# EAGLE design Spectacle_LED_Control_Board (EAGLE 7.6.0)
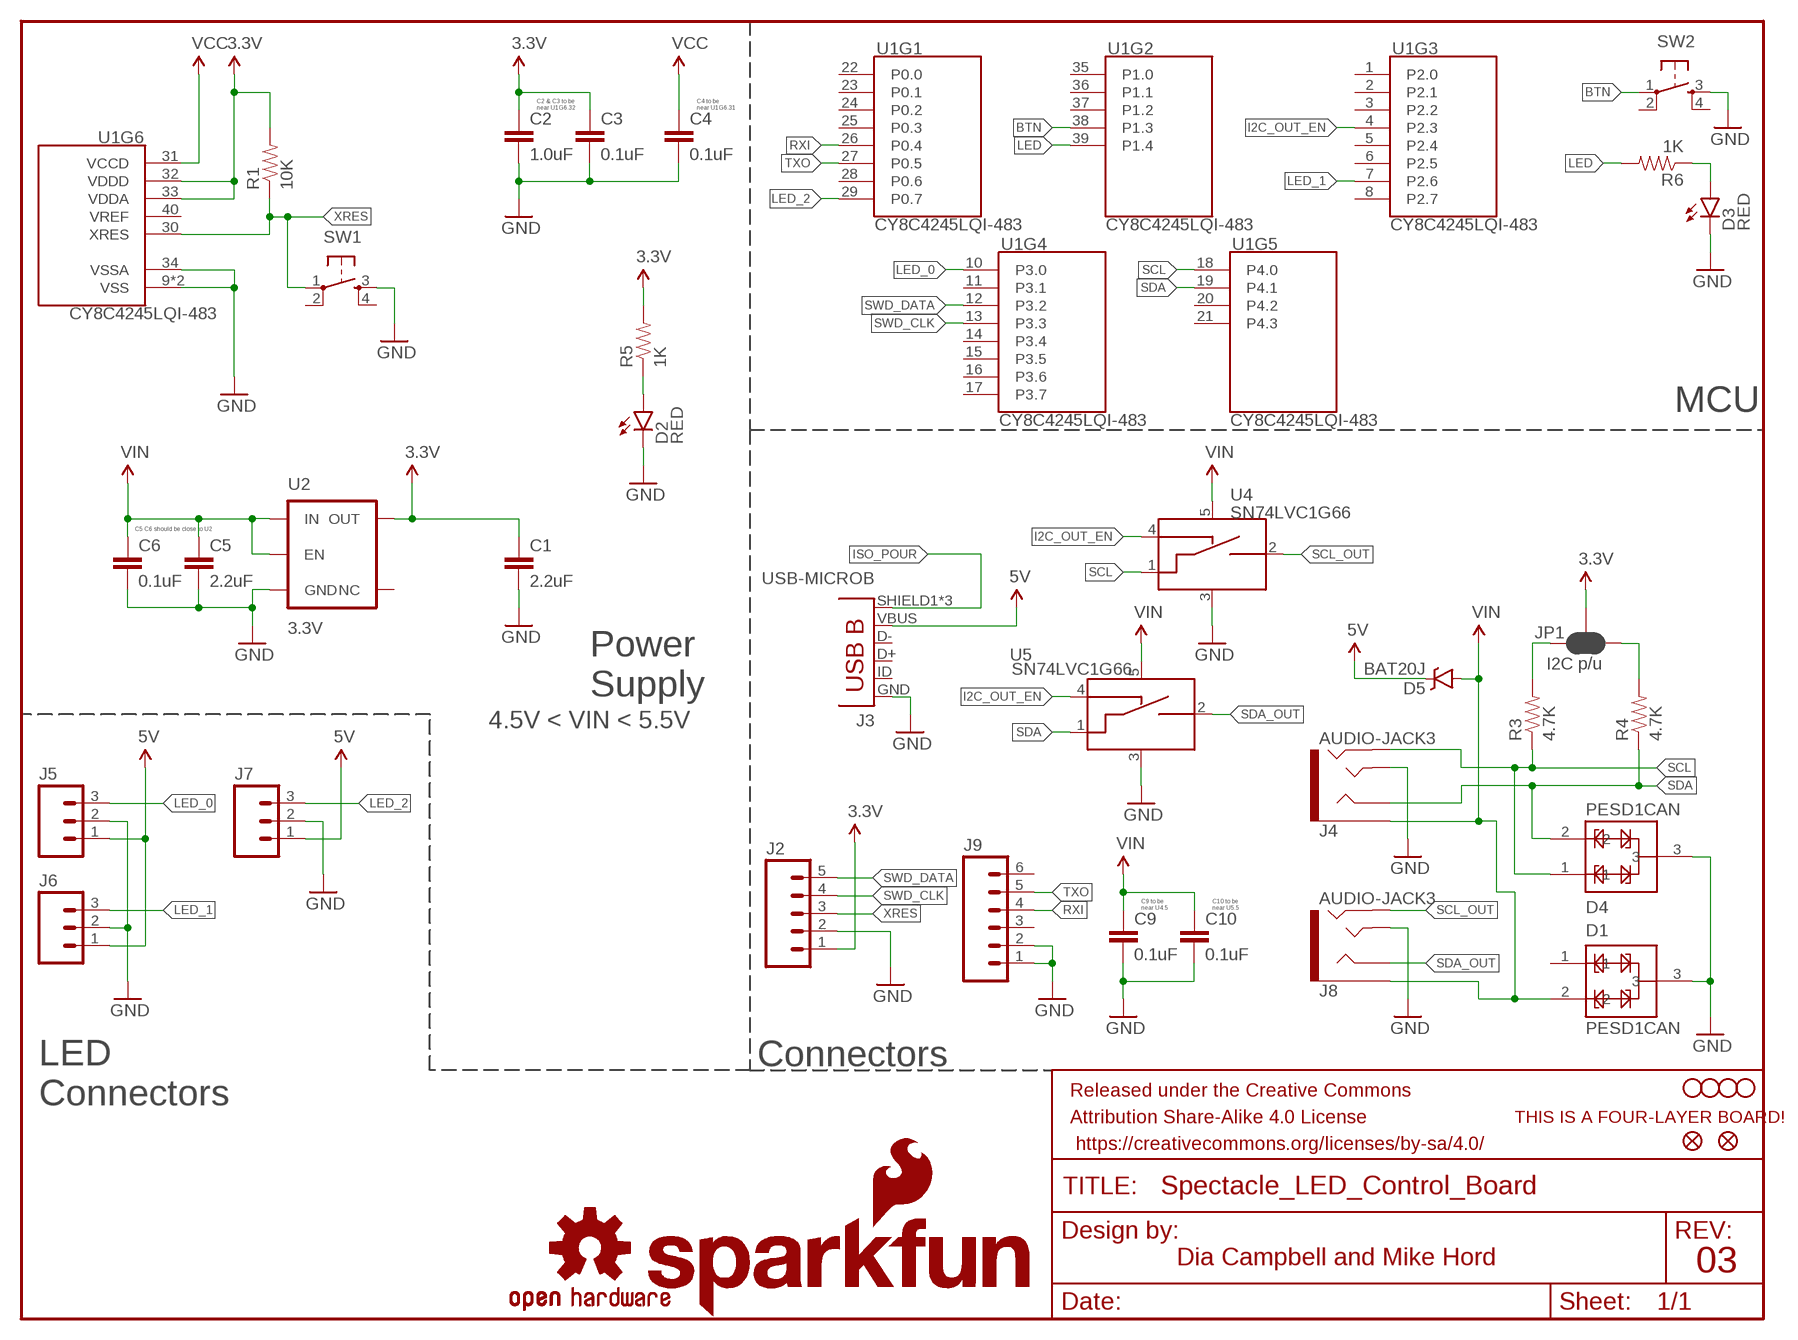
[diagram p0: schematic, sheet 1]

## Parts
C1  2.2uF  2.2UF-10V-20%(0603)  [0603-CAP]
C2  1.0uF  1.0UF-16V-10%(0402)  [0402-CAP]
C3  0.1uF  0.1UF-16V(+-10%)(0402)  [0402-CAP]
C4  0.1uF  0.1UF-16V(+-10%)(0402)  [0402-CAP]
C5  2.2uF  2.2UF-10V-20%(0603)  [0603-CAP]
C6  0.1uF  0.1UF-16V(+-10%)(0402)  [0402-CAP]
C9  0.1uF  0.1UF-16V(+-10%)(0402)  [0402-CAP]
C10  0.1uF  0.1UF-16V(+-10%)(0402)  [0402-CAP]
D1  PESD1CAN  [SOT23-3]
D2  RED  LED-RED0603  [LED-0603]
D3  RED  LED-RED0603  [LED-0603]
D4  PESD1CAN  [SOT23-3]
D5  BAT20J  DIODE-SCHOTTKY-BAT20J  [SOD-323]
FD1  FIDUCIALUFIDUCIAL  [MICRO-FIDUCIAL]
FD2  FIDUCIALUFIDUCIAL  [MICRO-FIDUCIAL]
FRAME1  FRAME-LETTER  [CREATIVE_COMMONS]
H1  STAND-OFF  [STAND-OFF]
H2  STAND-OFF  [STAND-OFF]
H3  STAND-OFF  [STAND-OFF]
H4  STAND-OFF  [STAND-OFF]
J2  M05NO_SILK  [1X05_NO_SILK]
J3  USB-MICROB  USB-MICROB"  [USB-B-MICRO-SMD_V03]
J4  AUDIO-JACK3  [AUDIO-JACK-TRRS-SMD]
J5  M03JST-PTH-VERT  [JST-3-PTH-VERT]
J6  M03JST-PTH-VERT  [JST-3-PTH-VERT]
J7  M03JST-PTH-VERT  [JST-3-PTH-VERT]
J8  AUDIO-JACK3  [AUDIO-JACK-TRRS-SMD]
J9  M06NO_SILK_NO_POP  [1X06_NO_SILK]
JP1  JUMPER-PAD-3-NC_BY_PASTE  [PAD-JUMPER-3-NC_BY_PASTE_YES_SILK_FULL_BOX]
LOGO1  OSHW-LOGOS  [OSHW-LOGO-S]
LOGO2  SFE_LOGO_NAME_FLAME.1_INCH  [SFE_LOGO_NAME_FLAME_.1]
R1  10K  10KOHM-1/10W-1%(0603)0603  [0603-RES]
R3  4.7K  4.7KOHM-1/10W-1%(0603)  [0603-RES]
R4  4.7K  4.7KOHM-1/10W-1%(0603)  [0603-RES]
R5  1K  1KOHM-1/10W-1%(0603)  [0603-RES]
R6  1K  1KOHM-1/10W-1%(0603)  [0603-RES]
SW1  SWITCH_SPST_4_PINRECT  [TACTILE_SWITCH_SMD_4.6X2.8MM]
SW2  SWITCH_SPST_4_PINRECT  [TACTILE_SWITCH_SMD_4.6X2.8MM]
U1  CY8C4245LQI-483  PSOC4_4200_40QFN  [QFN-40]
U2  3.3V  V_REG_AP2112K-3.3V  [SOT23-5]
U4  SN74LVC1G66  SN74LVC1G66_SPST_AMUX  [SOT23-5]
U5  SN74LVC1G66  SN74LVC1G66_SPST_AMUX  [SOT23-5]
U$1  FOUR_LAYER_WARNING  [FOUR_LAYER_WARNING]

## Nets
3.3V: C1.1 C2.1 C3.1 J2.1 JP1.2 R1.2 R5.2 U1.32(VDDD) U1.33(VDDA) U2.5(OUT)
5V: D5.C J3.VBUS J5.1 J6.1 J7.1
BTN: SW2.1 U1.38(P1.3)
GND: C1.2 C2.2 C3.2 C4.2 C5.2 C6.2 C9.2 C10.2 D1.3 D2.C D3.C D4.3 J2.2 J3.GND J4.TIP J5.2 J6.2 J7.2 J8.TIP J9.1 J9.2 SW1.3 SW2.3 U1.9(VSS) U1.34(VSSA) U1.EP(VSS) U2.2(GND) U4.3(VSS) U5.3(VSS)
I2C_OUT_EN: U1.4(P2.3) U4.4(CTRL_IN) U5.4(CTRL_IN)
ISO_POUR: J3.SHIELD1(SHIELD) J3.SHIELD2(SHIELD) J3.SHIELD3(SHIELD)
LED: R6.2 U1.39(P1.4)
LED_0: J5.3 U1.10(P3.0)
LED_1: J6.3 U1.7(P2.6)
LED_2: J7.3 U1.29(P0.7)
N$2: JP1.3 R3.2
N$4: D2.A R5.1
N$5: D3.A R6.1
N$6: JP1.1 R4.2
RXI: J9.4 U1.26(P0.4)
SCL: D4.1 J4.RING2 R3.1 U1.18(P4.0) U4.1(A_IN)
SCL_OUT: J8.RING2 U4.2(A_OUT)
SDA: D4.2 J4.RING1 R4.1 U1.19(P4.1) U5.1(A_IN)
SDA_OUT: J8.RING1 U5.2(A_OUT)
SWD_CLK: J2.4 U1.13(P3.3)
SWD_DATA: J2.5 U1.12(P3.2)
TXO: J9.5 U1.27(P0.5)
VCC: C4.1 U1.31(VCCD)
VIN: C5.1 C6.1 C9.1 C10.1 D1.2 D5.A J4.EARTH J8.EARTH U2.1(IN) U2.3(EN) U4.5(VCC) U5.5(VCC)
XRES: J2.3 R1.1 SW1.1 U1.30(XRES)
Unconnected: D1.1 J3.D+ J3.D- J3.ID(USBID) J9.3 J9.6 SW1.2 SW1.4 SW2.2 SW2.4 U1.1(P2.0) U1.2(P2.1) U1.3(P2.2) U1.5(P2.4) U1.6(P2.5) U1.8(P2.7) U1.11(P3.1) U1.14(P3.4) U1.15(P3.5) U1.16(P3.6) U1.17(P3.7) U1.20(P4.2) U1.21(P4.3) U1.22(P0.0) U1.23(P0.1) U1.24(P0.2) U1.25(P0.3) U1.28(P0.6) U1.35(P1.0) U1.36(P1.1) U1.37(P1.2) U1.40(VREF) U2.4(NC)

## Notes on the sheet
- C2 & C3 to be
  near U1G6.32
- C4 to be
  near U1G6.31
- MCU
- C5 C6 should be close to U2
- I2C p/u
- Power
  Supply
- 4.5V < VIN < 5.5V
- C9 to be
  near U4.5
- C10 to be
  near U5.5
- Connectors
- LED 
  Connectors
- Dia Campbell and Mike Hord
- 03

## Library data of the parts
C1 C5 = SparkFun-Capacitors:2.2UF-10V-20%(0603): CAP-07888; PROD_ID: CAP-07888
C2 = SparkFun-Capacitors:1.0UF-16V-10%(0402); PROD_ID: CAP-12417
C3 C4 C6 C9 C10 = SparkFun-Capacitors:0.1UF-16V(+-10%)(0402); PROD_ID: CAP-12416
D1 D4 = SparkFun-DiscreteSemi:PESD1CAN: PESD1CAN is used to protect two automotive CAN bus lines from ESD.; PROD_ID: DIO-12501
D2 D3 = SparkFun-LED:LED-RED: Assorted Red LEDs LilyPad 1206- DIO-09912 1206- DIO-00809 0603- DIO-00819 "SMART" means more efficient and expensive; PROD_ID: DIO-00819
D5 = SparkFun-DiscreteSemi:DIODE-SCHOTTKY: Schottky diodes in SFE's production catalog BAT20J 1A 23V 0.62Vf RB751 120mA 40V 0.37Vf PMEG4005EJ 0.5A 40V 0.42Vf MBRA140 1A 40V 0.5Vf B340A 3A 40V SMA; PROD_ID: DIO-11623
FD1 FD2 = SparkFun-Aesthetics:FIDUCIAL: Fiducial Alignment Points Various fiducial points for machine vision alignment.
FRAME1 = SparkFun-Aesthetics:FRAME-LETTER: Schematic Frame Standard 8.5x11 US Letter frame
H1-H4 = SparkFun-Electromechanical:STAND-OFF: #4 Stand Off This is the mechanical footprint for a #4 phillips button head screw. Use the keepout ring to avoid running the screw head into surrounding components. SKU : PRT-00447
J2 = SparkFun-Connectors:M05: Header 5 Standard 5-pin 0.1" header. Use with straight break away headers (SKU : PRT-00116), right angle break away headers (PRT-00553), swiss pins (PRT-00743), machine pins (PRT-00117), and female headers (PRT-00115). Molex polarized connector foot print use with SKU : PRT-08230 with associated crimp pins and housings.
J3 = SparkFun-Connectors:USB-MICROB; PROD_ID: CONN-11752
J4 J8 = SparkFun-Connectors:AUDIO-JACK3: Audio jack - 3.5mm TRRS variety - two rings.
J5-J7 = SparkFun-Connectors:M03: Header 3 Standard 3-pin 0.1" header. Use with straight break away headers (SKU : PRT-00116), right angle break away headers (PRT-00553), swiss pins (PRT-00743), machine pins (PRT-00117), and female headers (PRT-00115). Molex polarized connector foot print use with SKU : PRT-08232 with associated crimp pins and housings.; PROD_ID: CONN-13230
J9 = SparkFun-Connectors:M06: Header 6 Standard 6-pin 0.1" header. Use with straight break away headers (SKU : PRT-00116), right angle break away headers (PRT-00553), swiss pins (PRT-00743), machine pins (PRT-00117), and female headers (PRT-00115). Molex polarized connector foot print use with SKU : PRT-08094 with associated crimp pins and housings. NOTES ON THE VARIANTS LOCK and LOCK_LONGPADS... This footprint was designed to help hold the alignment of a through-hole component (i.e. 6-pin header) while soldering it into place. You may notice that each hole has been shifted either up or down by 0.005 of an inch from it's more standard position (which is a perfectly straight line). This slight alteration caused the pins (the squares in the middle) to touch the edges of the holes. Because they are alternating, it causes a "brace" to hold the component in place. 0.005 has proven to be the perfect amount of "off-center" position when using our standard breakaway headers. Although looks a little odd when you look at the bare footprint, once you have a header in there, the alteration is very hard to notice. Also,if you push a header all the way into place, it is covered up entirely on the bottom side. This idea of altering the position of holes to aid alignment will be further integrated into the Sparkfun Library for other footprints. It can help hold any component with 3 or more connection pins.
JP1 = SparkFun-Passives:JUMPER-PAD-3-NC_BY_PASTE
LOGO1 = SparkFun-Aesthetics:OSHW-LOGO: Open Source Hardware Logo This logo indicates the piece of hardware it is found on incorporates a OSHW license and/or adheres to the definition of open source hardware found here: http://freedomdefined.org/OSHW
LOGO2 = SparkFun-Aesthetics:SFE_LOGO_NAME_FLAME: SFE Logo, name and flame This is the SparkFun full logo. The logo on the schematic will always be the same size; the package variant is the height of the flame part of the logo. Default layer for the logo on the board is tSilk.
R1 = SparkFun-Resistors:10KOHM-1/10W-1%(0603): RES-00824; PROD_ID: RES-00824
R3 R4 = SparkFun-Resistors:4.7KOHM-1/10W-1%(0603): RES-07857; PROD_ID: RES-07857
R5 R6 = SparkFun-Resistors:1KOHM-1/10W-1%(0603): RES-07856; PROD_ID: RES-07856
SW1 SW2 = SparkFun-Electromechanical:SWITCH_SPST_4_PIN; PROD_ID: SWCH-13065
U1 = SparkFun-IC-Microcontroller:PSOC4_4200_40QFN: Cypress PSoC 4200 32-bit MCU 48-MHz ARM Cortex-M0 Datasheet <http://www.cypress.com/file/138656/download> SparkFun Products: SparkFun serial Controlled Motor Driver <https://www.sparkfun.com/products/13911>; PROD_ID: IC-13292
U2 = SparkFun-PowerIC:V_REG_AP2112: AP2112 - 600mA CMOS LDO Regulator w/ Enable The AP2112 is CMOS process low dropout linear regulator with enable function, the regulator delivers a guaranteed 600mA (min.) continuous load current. Features Output Voltage Accuracy: ±1.5% Output Current: 600mA (Min.) Foldback Short Current Protection: 50mA Enable Function to Turn ON/OFF VOUT Low Dropout Voltage (3.3V): 250mV (Typ.) @IOUT=600mA Excellent Load Regulation: 0.2%/A (Typ.) Excellent Line Regulation: 0.02%/V (Typ.) Low Quiescent Current: 55μA (Typ.) Low Standby Current: 0.01μA (Typ.) Low Output Noise: 50μVRMS PSRR: 100Hz -65dB, 1kHz -65dB OTSD Protection Stable with 1.0μF Flexible Cap: Ceramic, Tantalum and Aluminum Electrolytic Operation Temperature Range: -40°C to 85°C ESD: MM 400V, HBM 4000V; PROD_ID: VREG-12457
U4 U5 = SparkFun-AnalogIC:SN74LVC1G66_SPST_AMUX: SPST NO Analog Switch 10-Ohm on resistance 1.65-5.5V; PROD_ID: IC-13549
U$1 = SparkFun-Aesthetics:FOUR_LAYER_WARNING: Warning text which will appear on both the schematic and the board file, notifying viewers that the design is a four-layer PCB.

## Board
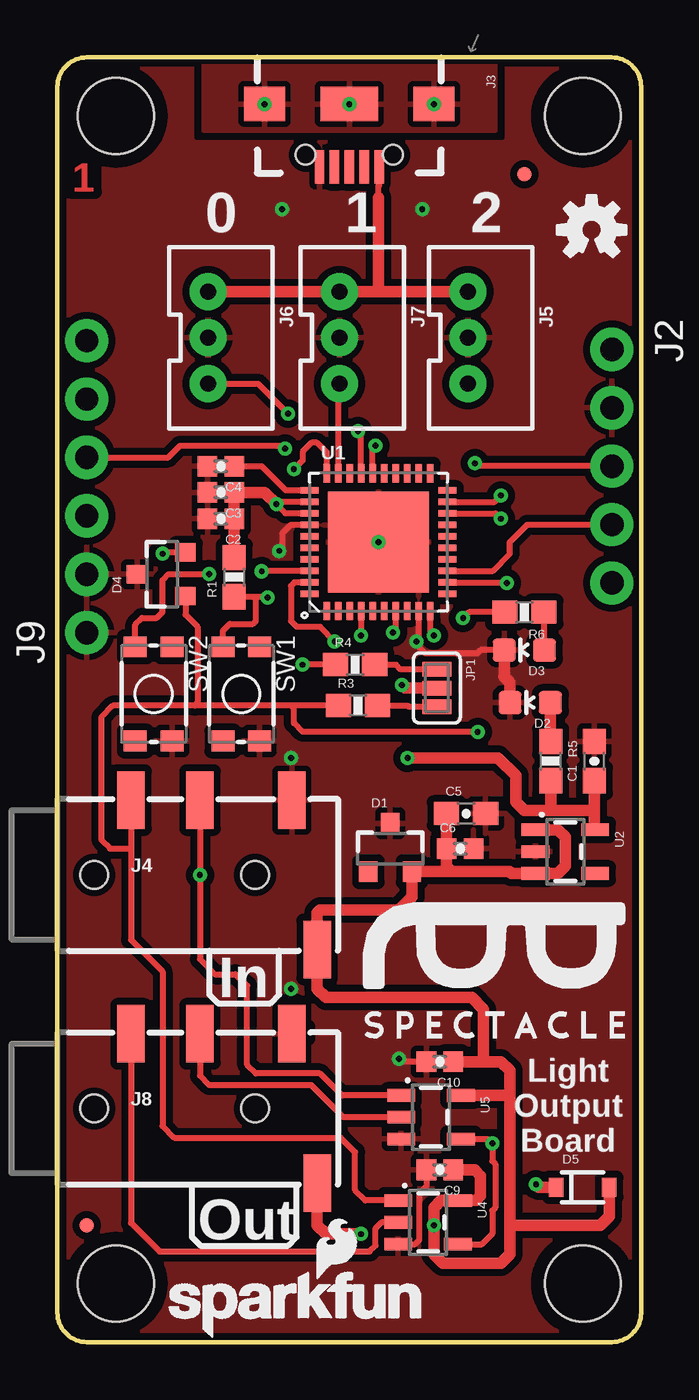
[diagram p1: board, top side]
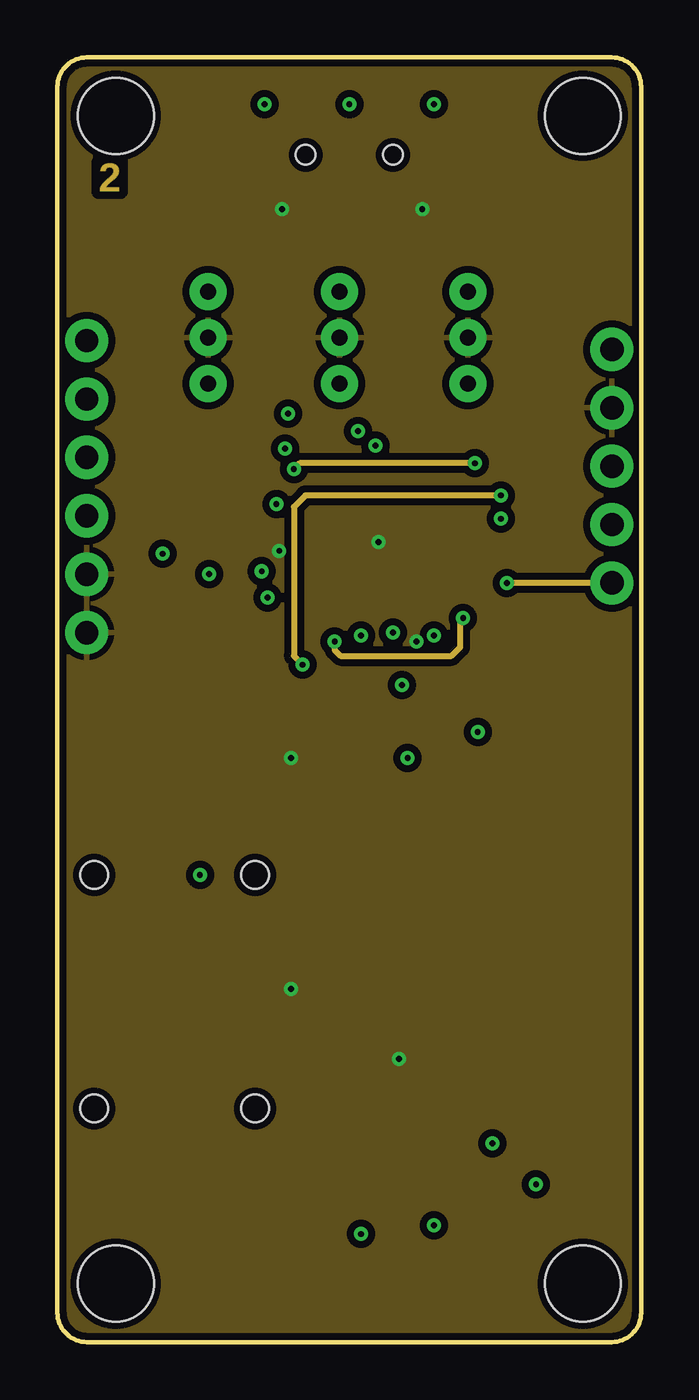
[diagram p2: board, inner layer Route2]
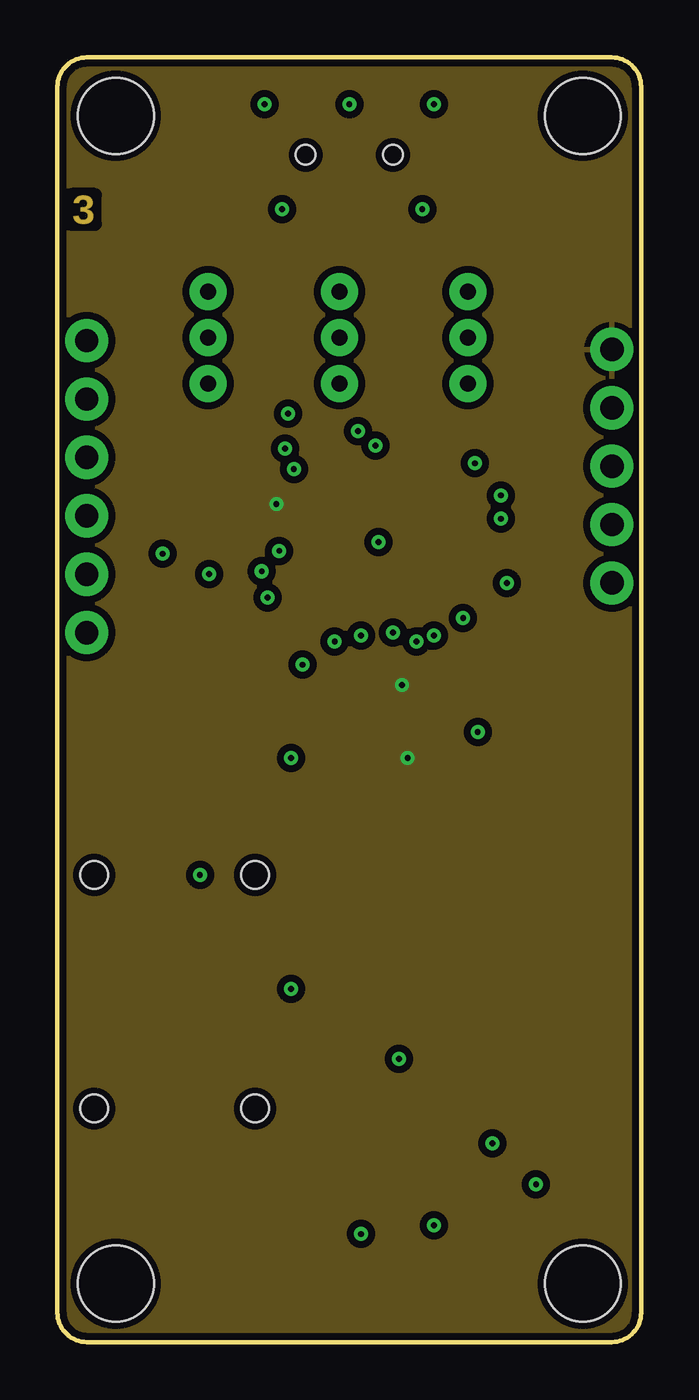
[diagram p3: board, inner layer Route15]
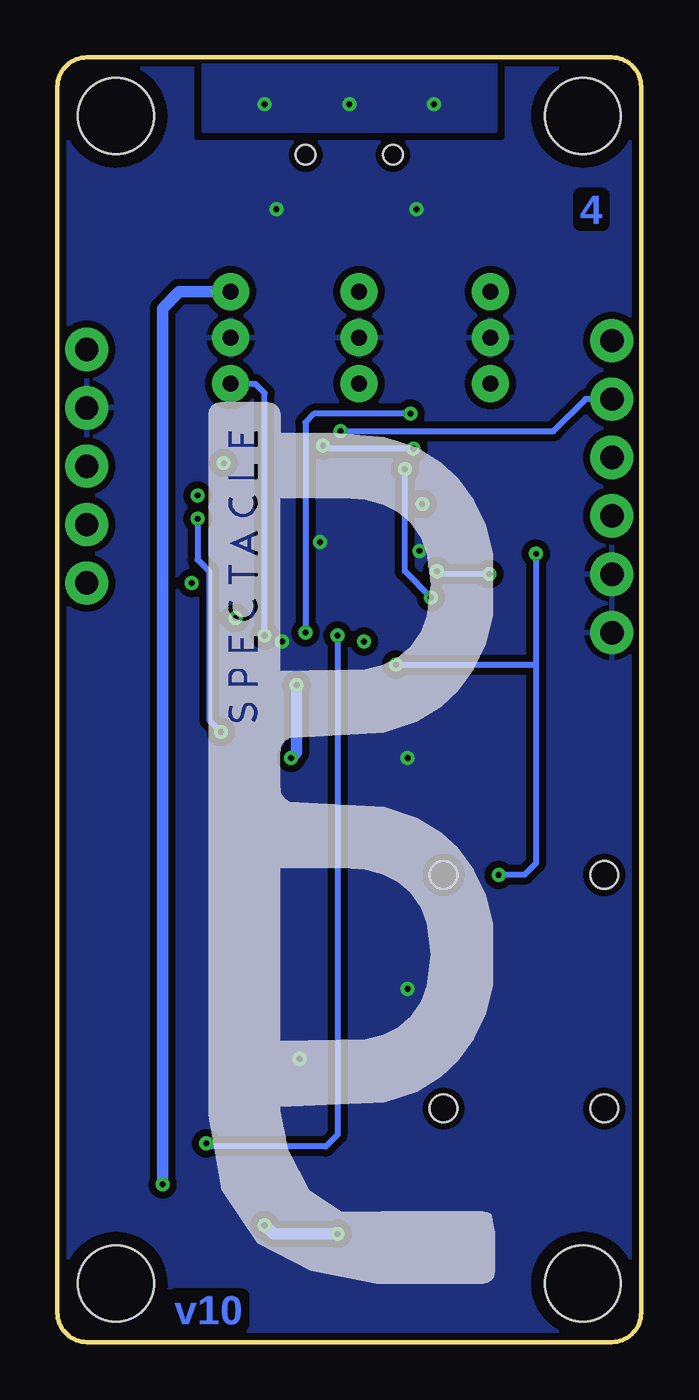
[diagram p4: board, bottom side, seen from below]

Size 25.4 x 55.88 mm. Coordinates in mm from the lower left corner, seen from the top.
Outline: 24.13,0 1.27,0 arc-90 0,1.27 0,54.61 arc-90 1.27,55.88 24.13,55.88 arc-90 25.4,54.61 25.4,1.27 arc-90 24.13,0
Copper layers (1*2*15*16): Top 0.035559375mm / dielectric 0.47751875mm / Route2 0.035559375mm / dielectric 0.47751875mm / Route15 0.035559375mm / dielectric 0.47751875mm / Bottom 0.035559375mm
Design rules "SparkFun-4-layer-TIGHT": minimum track width 7mil, minimum drill 15mil, track to track 7mil, track to pad 7mil, pad to pad 7mil, via to via 7mil, smd to smd 7mil, copper to edge 7mil, drill to drill 7mil, minimum pad ring 7mil, minimum via ring 7mil, stop-mask expansion 4mil, vias tented up to drill 25mil, thermal gap 10mil
tRestrict: area 10.8,13.2 to 10.9,13.7; area 9.9,14.6 to 10.4,14.9; area 10,12.1 to 10.4,12.2

### Footprints (pad centres in the part's own frame; a part is rotated, then mirrored left to right if it is on the bottom)
0603-CAP = smd 1.1 x 1: 1 -0.85,0; 2 0.85,0
0402-CAP = smd 0.85 x 0.9: 1 -0.58,0; 2 0.58,0
SOT23-3 = smd 0.8 x 0.9: 1 -0.95,-1; 2 0.95,-1; 3 0,1.1
LED-0603 = smd 1 x 1: A 0,-0.877; C 0,0.877
SOD-323 = smd 0.63 x 0.83: A 1.15,0; C -1.15,0
MICRO-FIDUCIAL = smd 0.635 x 0.635: 1 0,0
STAND-OFF = hole 3.302: 0,0
1X05_NO_SILK = drill 1.016 pad 1.88: 1 0,0; 2 2.54,0; 3 5.08,0; 4 7.62,0; 5 10.16,0
USB-B-MICRO-SMD_V03 = smd 1.45 x 0.4: D+ 2.725,0; D- 2.725,0.65; GND 2.725,-1.3; ID 2.725,-0.65; VBUS 2.725,1.3 | smd 1.5 x 1.8: SHIELD1 0,3.685; SHIELD2 0,-3.685 | smd 1.5 x 2.5: SHIELD3 0,0 | hole 0.85: 2.2,1.9; 2.2,-1.9
AUDIO_JACK_3.5MM_TRRS_SMD_RA = smd 1.2 x 2.5: EARTH 11.3,-3.25; RING1 6.2,3.25; RING2 3.2,3.25; TIP 10.2,3.25 | hole 1.2: 1.6,0; 8.6,0
JST-3-PTH-VERT = drill 0.7 pad 1.6: 1 -2,-0.55; 2 0,-0.55; 3 2,-0.55
1X06_NO_SILK = drill 1.016 pad 1.88: 1 0,0; 2 2.54,0; 3 5.08,0; 4 7.62,0; 5 10.16,0; 6 12.7,0
PAD-JUMPER-3-NC_BY_PASTE_YES_SILK_FULL_BOX = smd 0.635 x 1.27: 1 -0.813,0; 2 0,0; 3 0.813,0
0603-RES = smd 1.1 x 1: 1 -0.85,0; 2 0.85,0
TACTILE_SWITCH_SMD_4.6X2.8MM = smd 0.9 x 1: 1 -2.05,-0.8; 2 2.05,-0.8; 3 2.05,0.8; 4 -2.05,0.8
QFN-40 = smd 0.285 x 0.8: 1 -2.25,-3; 2 -1.75,-3; 3 -1.25,-3; 4 -0.75,-3; 5 -0.25,-3; 6 0.25,-3; 7 0.75,-3; 8 1.25,-3; 9 1.75,-3; 10 2.25,-3; 21 2.25,3; 22 1.75,3; 23 1.25,3; 24 0.75,3; 25 0.25,3; 26 -0.25,3; 27 -0.75,3; 28 -1.25,3; 29 -1.75,3; 30 -2.25,3 | smd 0.8 x 0.285: 11 3,-2.25; 12 3,-1.75; 13 3,-1.25; 14 3,-0.75; 15 3,-0.25; 16 3,0.25; 17 3,0.75; 18 3,1.25; 19 3,1.75; 20 3,2.25; 31 -3,2.25; 32 -3,1.75; 33 -3,1.25; 34 -3,0.75; 35 -3,0.25; 36 -3,-0.25; 37 -3,-0.75; 38 -3,-1.25; 39 -3,-1.75; 40 -3,-2.25 | smd 4.4 x 4.4: EP 0,0
SOT23-5 = smd 0.55 x 1.2: 1 -0.95,-1.3; 2 0,-1.3; 3 0.95,-1.3; 4 0.95,1.3; 5 -0.95,1.3

### Placement (x,y rotation side)
C1  23.37,25.27 90 top
C2  7.11,35.81 180 top
C3  7.11,36.96 180 top
C4  7.11,38.1 180 top
C5  17.78,22.99 0 top
C6  17.53,21.46 0 top
C9  16.64,7.49 180 top
C10  16.64,12.19 180 top
D1  14.48,21.46 0 top
D2  20.57,27.81 90 top
D3  20.32,30.1 90 top
D4  4.57,33.4 90 top
D5  22.86,6.73 0 top
FD1  1.27,5.08 0 top
FD2  20.32,50.8 0 top
FRAME1  49.53,52.07 0 top  (outside the outline)
H1  22.86,53.34 0 top
H2  2.54,53.34 0 top
H3  22.86,2.54 0 top
H4  2.54,2.54 0 top
J2  24.13,43.18 270 top
J3  12.7,53.85 270 top
J4  AUDIO_JACK_TRRSSMD_RA  [AUDIO_JACK_3.5MM_TRRS_SMD_RA]  0,20.32 0 top
J5  JST_2MM  [JST-3-PTH-VERT]  18.41,43.69 270 top
J6  JST_2MM  [JST-3-PTH-VERT]  7.11,43.69 270 top
J7  JST_2MM  [JST-3-PTH-VERT]  12.83,43.69 270 top
J8  AUDIO_JACK_TRRSSMD_RA  [AUDIO_JACK_3.5MM_TRRS_SMD_RA]  0,10.16 0 top
J9  1.27,30.86 90 top
JP1  16.51,28.45 270 top
LOGO1  23.24,48.39 0 top
LOGO2  4.45,0.13 0 top
R1  7.7,33.27 90 top
R3  13.08,27.69 0 top
R4  12.95,29.46 0 top
R5  21.46,25.27 270 top
R6  20.32,31.75 180 top
SW1  8,28.19 270 top
SW2  4.19,28.19 270 top
U1  13.97,34.8 0 top
U2  22.1,21.34 270 top
U4  16.13,5.21 270 top
U5  16.26,9.78 270 top
U$1  34.29,35.56 0 top  (outside the outline)
U$2  [ORDERING_INSTRUCTIONS]  30.48,49.53 0 top  (outside the outline)

### Tracks (layer width: path | path; a pad name or v marks a point on that pad's centre or on a via)
3.3V  (via drill 0.25)
  Top 0.254: U1.32 9.62,36.55 v9.53,36.45 9.93,36.05 U1.33
  Top 0.508: JP1.2 15.11,28.45 v14.99,28.57 | v9.53,36.45 9.02,36.96 C3.1 C2.1 R1.2 | C1.1 23.37,23.11 | 23.37,23.11 23.37,22.32 U2.5 | v15.24,25.4 19.18,25.4 19.94,24.64 19.94,23.5 20.32,23.11 21.34,23.11 | 21.34,23.11 23.37,23.11 | R5.2 21.46,23.24 21.34,23.11
  Bottom 0.508: v14.99,28.57 14.99,25.65 v15.24,25.4
  pour Route15 (isolate 0.305): 24.13,0 1.27,0 arc-90 0,1.27 0,54.61 arc-90 1.27,55.88 24.13,55.88 arc-90 25.4,54.61 25.4,1.27 arc-90
5V  (via drill 0.25)
  Top 0.254: J3.VBUS 14,50.32 13.97,50.29 13.97,49.78
  Top 0.508: J6.1 J7.1 13.97,45.69 | J5.1 13.97,45.69 | 13.97,49.78 13.97,45.69 | D5.C 20.95,6.73 v20.83,6.86
  Bottom 0.508: J5.1 20.1,45.69 20.83,44.96 v20.83,6.86
BTN  (via drill 0.25)
  Top 0.254: SW2.1 3.39,31.2 3.68,31.5 4.32,31.5 4.57,31.75 4.57,33.15 4.83,33.4 v6.6,33.4 | U1.38 8.91,33.55 v8.89,33.53
  Bottom 0.254: v6.6,33.4 8.76,33.4 v8.89,33.53
GND  (via drill 0.25)
  Top 0.254: U4.3 15.56,4.26 15.75,4.45 15.75,6.48 16.06,6.79 C9.2 | U1.9 15.72,30.58 v15.62,30.48 15.62,30.35 16,29.97 18.29,29.97 18.41,30.1 D3.C | U1.34 10.15,35.55 9.78,35.18 9.78,34.54 v9.65,34.42 | C10.2 14.99,12.19 v14.86,12.32
  Top 0.508: D2.C 19.7,28.69 19.43,28.96 19.44,28.97 D3.C
  other vias: 13.97,34.8 10.16,25.4 10.16,15.37 9.78,49.28 15.88,49.28
  pour Bottom (isolate 0.305, rank 2): 0,1.27 0,54.61 arc-90 1.27,55.88 24.13,55.88 arc-90 25.4,54.61 25.4,1.27 arc-90 24.13,0 1.27,0 arc-90
  pour Top (isolate 0.305, rank 2): 0,1.27 0,54.61 arc-90 1.27,55.88 24.13,55.88 arc-90 25.4,54.61 25.4,1.27 arc-90 24.13,0 1.27,0 arc-90
  pour Route2 (isolate 0.305): 24.13,0 1.27,0 arc-90 0,1.27 0,54.61 arc-90 1.27,55.88 24.13,55.88 arc-90 25.4,54.61 25.4,1.27 arc-90
I2C_OUT_EN  (via drill 0.25)
  Top 0.254: U4.4 18.48,4.26 18.92,4.7 18.92,5.71 19.05,5.84 19.05,7.75 18.92,7.87 v18.92,8.64 18.73,8.83 U5.4 | U1.4 13.22,30.75 v13.21,30.73
  Bottom 0.254: v13.21,30.73 13.21,9.02 13.72,8.51 18.8,8.51 v18.92,8.64
ISO_POUR  (via drill 0.25)
  other vias: 12.7,53.85 9.02,53.85 16.38,53.85
  pour Top: 6.35,55.88 6.35,52.7 19.05,52.7 19.05,55.88
  pour Bottom: 6.35,55.88 6.35,52.7 19.05,52.7 19.05,55.88
LED  (via drill 0.25)
  Top 0.254: U1.39 10.31,33.05 10.16,32.89 10.16,31.37 10.41,31.11 11.43,31.11 v12.06,30.48 | R6.2 17.91,31.75 v17.65,31.5
  Route2 0.254: v17.65,31.5 17.53,31.37 17.53,30.23 17.14,29.84 12.32,29.84 12.06,30.1 v12.06,30.48
LED_0  (via drill 0.25)
  Top 0.254: U1.10 16.22,30.9 v16.38,30.73
  Bottom 0.254: v16.38,30.73 16.38,41.27 16.8,41.69 J5.3
LED_1  (via drill 0.25)
  Top 0.254: J6.3 8.73,41.69 v10.03,40.39 | U1.7 14.72,30.98 v14.61,30.86
  Bottom 0.254: v10.03,40.39 14.22,40.39 14.61,40.01 v14.61,30.86
LED_2
  Top 0.254: U1.29 12.22,41.63 J7.3
N$2
  Top 0.254: R3.2 15.24,27.69 15.29,27.64 JP1.3
N$4
  Top 0.508: 21.48,26.14 R5.1 21.45,26.14 D2.A
N$5
  Top 0.254: R6.1 21.17,30.13
  Top 0.508: 21.17,30.13 D3.A
N$6
  Top 0.254: R4.2 14.73,29.46 14.94,29.26 JP1.1
RXI  (via drill 0.25)
  Top 0.254: J9.4 4.83,38.48 5.33,38.99 9.78,38.99 v9.91,38.86 | U1.26 13.72,38.87 v13.84,38.99
  Bottom 0.254: v9.91,38.86 13.72,38.86 v13.84,38.99
SCL  (via drill 0.25)
  Top 0.254: J4.RING2 3.2,21.46 | 3.2,21.46 3.2,17.5 4.57,16.13 4.57,9.4 5.08,8.89 12.32,8.89 12.95,8.26 12.95,6.6 13.4,6.16 U4.1 | U1.18 19.07,36.05 v19.3,35.81 | D4.1 5.57,31.64 6.1,31.11 6.1,27.81 5.97,27.69 | R3.1 10.16,27.69 | 10.16,27.69 5.97,27.69 | 5.97,27.69 2.41,27.69 1.91,27.18 1.91,21.84 2.29,21.46 3.2,21.46 | v18.29,26.54 10.67,26.54 10.29,26.92 10.29,27.56 10.16,27.69
  Bottom 0.254: v19.3,35.81 19.3,34.04 18.8,33.53 18.8,27.05 v18.29,26.54
SCL_OUT
  Top 0.254: U4.2 14.1,5.21 13.84,4.95 13.84,4.19 13.59,3.94 4.45,3.94 3.2,5.18 J8.RING2
SDA  (via drill 0.25)
  Top 0.254: J4.RING1 v6.2,20.32 6.2,16.66 6.86,16 7.75,16 8.26,15.49 8.26,12.06 8.64,11.68 11.43,11.68 12.38,10.73 U5.1 | U1.19 19.02,36.55 v19.3,36.83 | D4.2 4.63,34.35 v4.57,34.29 | R4.1 v10.67,29.46
  Route2 0.254: v19.3,36.83 10.79,36.83 10.29,36.32 10.29,29.84 v10.67,29.46
  Bottom 0.254: v4.57,34.29 4.57,29.46 | 4.57,29.46 4.57,20.83 5.08,20.32 v6.2,20.32 | v10.67,29.46 4.57,29.46
SDA_OUT
  Top 0.254: U5.2 12.45,9.78 11.05,11.18 6.6,11.18 6.2,11.58 J8.RING1
SWD_CLK
  Top 0.254: U1.13 18.94,33.55 19.68,34.29 19.68,34.8 20.45,35.56 J2.4
SWD_DATA  (via drill 0.25)
  Top 0.254: U1.12 19.53,33.05 v19.56,33.02
  Route2 0.254: J2.5 v19.56,33.02
TXO  (via drill 0.25)
  Top 0.254: U1.27 13.22,39.48 v13.08,39.62
  Bottom 0.254: v13.08,39.62 3.81,39.62 2.41,41.02 J9.5
VCC
  Top 0.254: U1.31 9.94,37.05 8.89,38.1 C4.1
VIN  (via drill 0.25)
  Top 0.508: C9.1 18.16,7.49 18.41,7.24 18.41,6.35 18.22,6.16 U4.5 16.7,6.16 16.38,5.84 v16.38,5.08 16.38,3.81 16.77,3.42 16.78,3.43 19.3,3.43 19.68,3.81 19.68,4.95 | J8.EARTH 11.3,5.08 11.68,4.7 v13.21,4.7 | U5.5 19.68,10.73 | C10.1 18.67,12.19 | 18.67,12.19 19.3,12.19 19.68,11.81 19.68,10.73 | U2.1 21.78,22.29 22.1,21.97 22.1,20.7 21.78,20.39 U2.3 19.75,20.39 19.67,20.46 17.14,20.46 | 18.67,12.19 18.54,12.32 18.54,14.48 18.03,14.99 11.68,14.99 11.3,15.37 J4.EARTH 11.3,18.67 11.43,18.8 14.86,18.8 15.43,19.36 D1.2 17.14,20.46 | C5.1 16.93,21.48 | 16.93,21.48 C6.1 | 16.93,21.48 16.93,20.68 17.14,20.46 | 19.68,10.73 19.68,4.95 | D5.A 24.01,5.47 23.62,5.08 19.81,5.08 19.68,4.95
  Bottom 0.508: v13.21,4.7 16,4.7 v16.38,5.08
XRES  (via drill 0.25)
  Top 0.254: U1.30 11.72,38.7 11.3,39.12 11.05,39.12 10.67,38.73 10.67,38.35 v10.29,37.97 | R1.1 8.51,32.42 | 8.51,32.42 9.11,32.42 v9.14,32.38 | SW1.1 7.2,30.95 7.49,31.24 8.51,31.24 8.64,31.37 8.64,32.3 8.51,32.42 | J2.3 18.29,38.1 v18.16,38.23
  Route2 0.254: v18.16,38.23 10.54,38.23 v10.29,37.97
  Bottom 0.254: v9.14,32.38 10.29,33.53 v10.29,37.97

### Text on the board
Top: 1
Route2: 2
Route15: 3
Bottom: 4 | v10
tPlace: 0 | 1 | 2 | In | Light / Output / Board | Out
Measures: (typ.) | (typ.) | Dimensions in inches
tDocu: Dia Campbell and Mike Hord | Soldeermask to be BLACK / Silkscreen to be WHITE